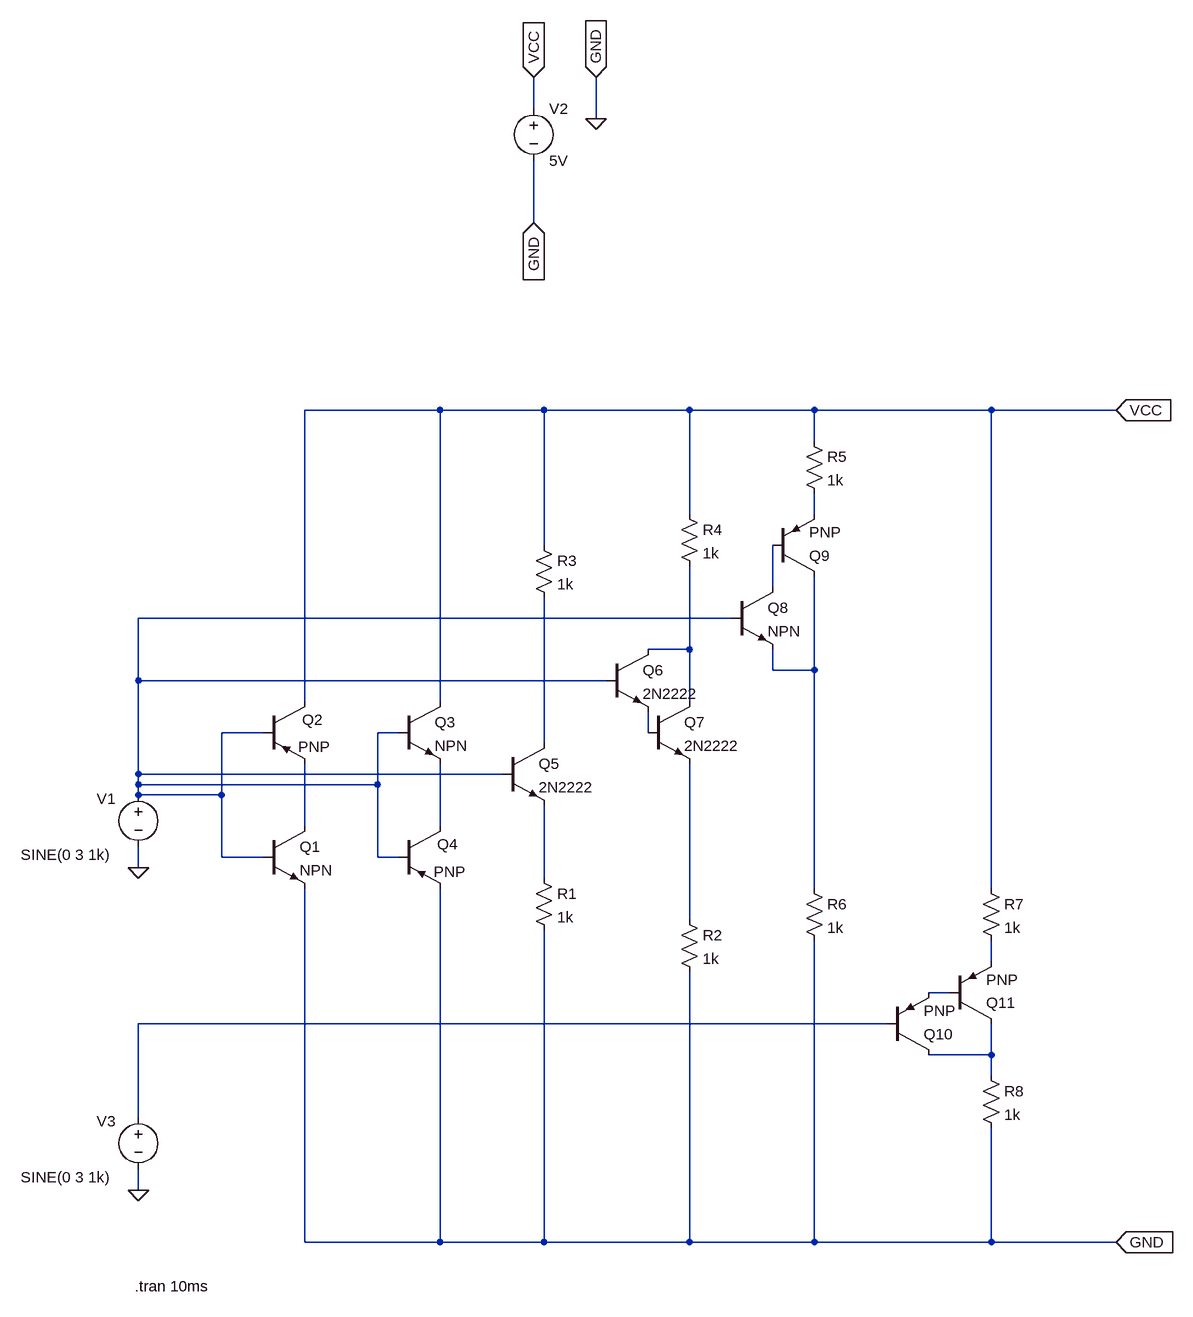
[diagram p0: schematic Darlington Test.asc]
Darlington Test.asc, the LTspice schematic file:
Version 4
SHEET 1 1120 1364
WIRE 112 -784 112 -832
WIRE 208 -768 208 -832
WIRE 112 -608 112 -704
WIRE -32 -320 -240 -320
WIRE 128 -320 -32 -320
WIRE 352 -320 128 -320
WIRE 544 -320 352 -320
WIRE 816 -320 544 -320
WIRE 1008 -320 816 -320
WIRE 544 -272 544 -320
WIRE 352 -160 352 -320
WIRE 544 -160 544 -192
WIRE 128 -112 128 -320
WIRE 480 -48 480 -112
WIRE 416 0 -496 0
WIRE 352 48 352 -80
WIRE 352 48 288 48
WIRE 480 80 480 48
WIRE 544 80 544 -64
WIRE 544 80 480 80
WIRE -496 96 -496 0
WIRE 224 96 -496 96
WIRE -240 128 -240 -320
WIRE -32 128 -32 -320
WIRE 352 128 352 48
WIRE -304 176 -368 176
WIRE -96 176 -128 176
WIRE 288 176 288 144
WIRE 128 192 128 -32
WIRE -496 240 -496 96
WIRE 64 240 -496 240
WIRE -496 256 -496 240
WIRE -128 256 -128 176
WIRE -128 256 -496 256
WIRE -496 272 -496 256
WIRE -368 272 -368 176
WIRE -368 272 -496 272
WIRE -240 320 -240 224
WIRE -32 320 -32 224
WIRE -368 368 -368 272
WIRE -304 368 -368 368
WIRE -128 368 -128 256
WIRE -96 368 -128 368
WIRE -496 384 -496 352
WIRE 128 400 128 288
WIRE 544 416 544 80
WIRE 816 416 816 -320
WIRE 352 464 352 224
WIRE 816 528 816 496
WIRE 752 576 720 576
WIRE 656 624 -496 624
WIRE 816 672 816 624
WIRE 816 672 720 672
WIRE 816 704 816 672
WIRE -496 768 -496 624
WIRE -496 880 -496 848
WIRE -240 960 -240 416
WIRE -32 960 -32 416
WIRE -32 960 -240 960
WIRE 128 960 128 480
WIRE 128 960 -32 960
WIRE 352 960 352 544
WIRE 352 960 128 960
WIRE 544 960 544 496
WIRE 544 960 352 960
WIRE 816 960 816 784
WIRE 816 960 544 960
WIRE 1008 960 816 960
FLAG 1008 -320 VCC
IOPIN 1008 -320 In
FLAG 1008 960 GND
IOPIN 1008 960 In
FLAG -496 384 0
FLAG 112 -832 VCC
IOPIN 112 -832 In
FLAG 208 -832 GND
IOPIN 208 -832 In
FLAG 208 -768 0
FLAG 112 -608 GND
IOPIN 112 -608 In
FLAG -496 880 0
SYMBOL npn -304 320 R0
SYMATTR InstName Q1
SYMBOL pnp -304 128 R0
WINDOW 0 60 28 Left 2
WINDOW 3 54 70 Left 2
SYMATTR InstName Q2
SYMBOL voltage -496 256 R0
WINDOW 0 -64 22 Left 2
WINDOW 3 -181 108 Left 2
WINDOW 123 0 0 Left 0
WINDOW 39 0 0 Left 0
SYMATTR InstName V1
SYMATTR Value SINE(0 3 1k)
SYMBOL voltage 112 -800 R0
SYMATTR InstName V2
SYMATTR Value 5V
SYMBOL npn -96 128 R0
SYMATTR InstName Q3
SYMBOL pnp -96 320 R0
WINDOW 0 60 28 Left 2
WINDOW 3 54 70 Left 2
SYMATTR InstName Q4
SYMBOL npn 64 192 R0
SYMATTR InstName Q5
SYMATTR Value 2N2222
SYMBOL res 112 384 R0
SYMATTR InstName R1
SYMATTR Value 1k
SYMBOL npn 224 48 R0
SYMATTR InstName Q6
SYMATTR Value 2N2222
SYMBOL npn 288 128 R0
SYMATTR InstName Q7
SYMATTR Value 2N2222
SYMBOL res 336 448 R0
SYMATTR InstName R2
SYMATTR Value 1k
SYMBOL res 112 -128 R0
SYMATTR InstName R3
SYMATTR Value 1k
SYMBOL res 336 -176 R0
SYMATTR InstName R4
SYMATTR Value 1k
SYMBOL npn 416 -48 R0
SYMATTR InstName Q8
SYMBOL pnp 480 -64 M180
SYMATTR InstName Q9
SYMBOL res 528 -288 R0
SYMATTR InstName R5
SYMATTR Value 1k
SYMBOL res 528 400 R0
SYMATTR InstName R6
SYMATTR Value 1k
SYMBOL pnp 656 672 M180
SYMATTR InstName Q10
SYMBOL pnp 752 624 M180
SYMATTR InstName Q11
SYMBOL voltage -496 752 R0
WINDOW 0 -64 22 Left 2
WINDOW 3 -181 108 Left 2
WINDOW 123 0 0 Left 0
WINDOW 39 0 0 Left 0
SYMATTR InstName V3
SYMATTR Value SINE(0 3 1k)
SYMBOL res 800 400 R0
SYMATTR InstName R7
SYMATTR Value 1k
SYMBOL res 800 688 R0
SYMATTR InstName R8
SYMATTR Value 1k
TEXT -502 1028 Left 2 !.tran 10ms

The netlist it stands for:
* Darlington Test.asc
Q1 N008 N003 0 0 NPN
Q2 VCC N003 N008 0 PNP
V1 N003 0 SINE(0 3 1k)
V2 VCC 0 5V
Q3 VCC N003 N009 0 NPN
Q4 N009 N003 0 0 PNP
Q5 N007 N003 N010 0 2N2222
R1 N010 0 1k
Q6 N004 N003 N006 0 2N2222
Q7 N004 N006 N011 0 2N2222
R2 N011 0 1k
R3 VCC N007 1k
R4 VCC N004 1k
Q8 N002 N003 N005 0 NPN
Q9 N005 N002 N001 0 PNP
R5 VCC N001 1k
R6 N005 0 1k
Q10 N015 N014 N013 0 PNP
Q11 N015 N013 N012 0 PNP
V3 N014 0 SINE(0 3 1k)
R7 VCC N012 1k
R8 N015 0 1k
.model NPN NPN
.model PNP PNP
.lib standard.bjt
.tran 10ms
.backanno
.end